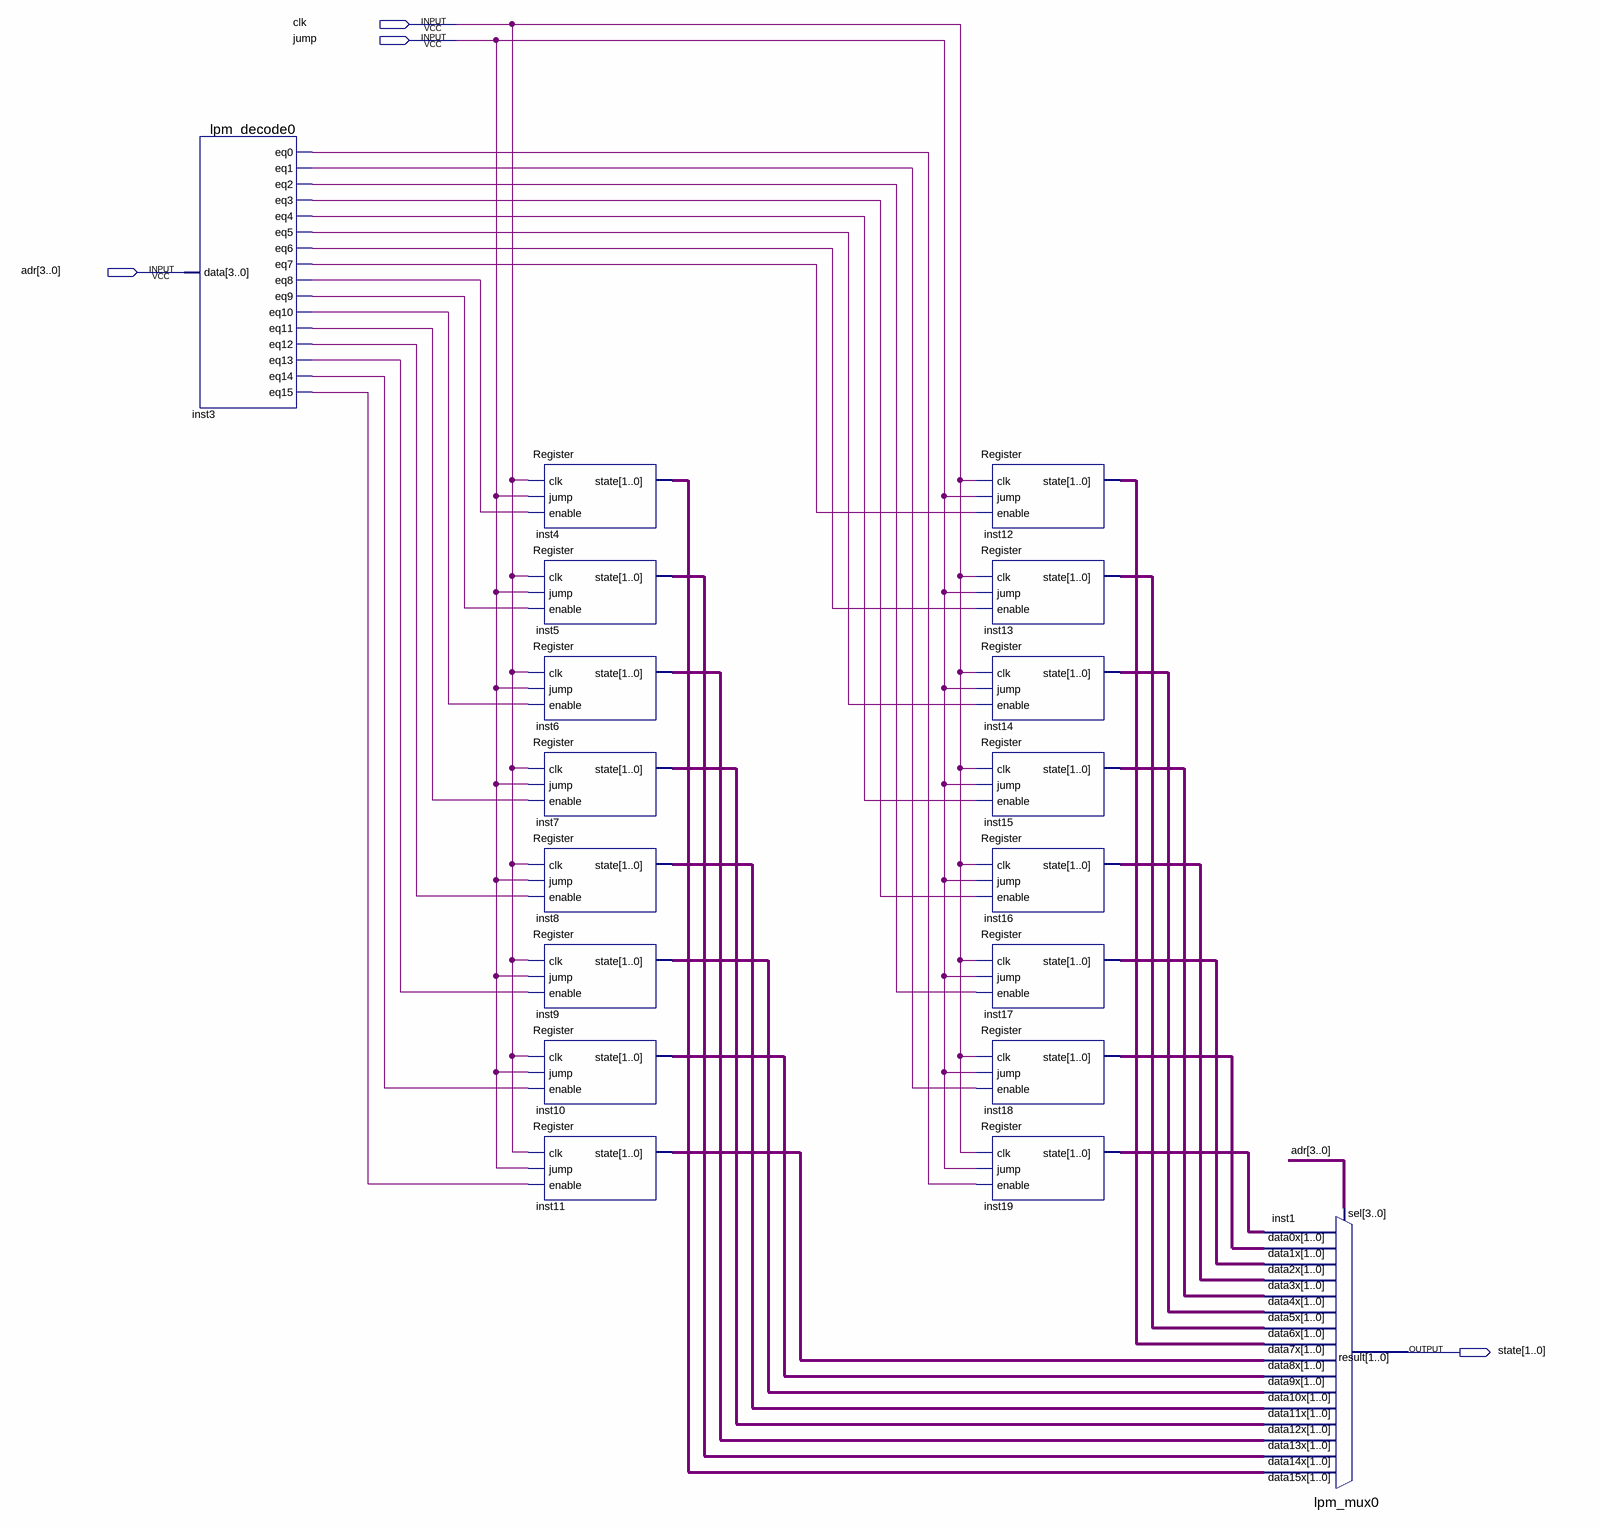
[diagram p0: schematic sheet]
// Quartus schematic PHT.bdf as structural Verilog: 18 symbols, 4 pins
module PHT (
  input  clk,
  input  jump,
  input  [3:0] adr,
  output [1:0] state
);

  wire inst3_eq0, inst3_eq1, inst3_eq2, inst3_eq3, inst3_eq4, inst3_eq5, inst3_eq6, inst3_eq7, inst3_eq8,
       inst3_eq9, inst3_eq10, inst3_eq11, inst3_eq12, inst3_eq13, inst3_eq14, inst3_eq15;
  wire [1:0] inst4_state, inst5_state, inst6_state, inst7_state, inst8_state, inst9_state, inst10_state,
       inst11_state, inst12_state, inst13_state, inst14_state, inst15_state, inst16_state, inst17_state,
       inst18_state, inst19_state;

  lpm_decode0 inst3 (
    .data(adr), .eq0(inst3_eq0), .eq1(inst3_eq1), .eq2(inst3_eq2), .eq3(inst3_eq3), .eq4(inst3_eq4),
    .eq5(inst3_eq5), .eq6(inst3_eq6), .eq7(inst3_eq7), .eq8(inst3_eq8), .eq9(inst3_eq9), .eq10(inst3_eq10),
    .eq11(inst3_eq11), .eq12(inst3_eq12), .eq13(inst3_eq13), .eq14(inst3_eq14), .eq15(inst3_eq15));
  Register inst4 (.clk(clk), .jump(jump), .enable(inst3_eq8), .state(inst4_state));
  Register inst5 (.clk(clk), .jump(jump), .enable(inst3_eq9), .state(inst5_state));
  Register inst6 (.clk(clk), .jump(jump), .enable(inst3_eq10), .state(inst6_state));
  Register inst7 (.clk(clk), .jump(jump), .enable(inst3_eq11), .state(inst7_state));
  Register inst8 (.clk(clk), .jump(jump), .enable(inst3_eq12), .state(inst8_state));
  Register inst9 (.clk(clk), .jump(jump), .enable(inst3_eq13), .state(inst9_state));
  Register inst10 (.clk(clk), .jump(jump), .enable(inst3_eq14), .state(inst10_state));
  Register inst11 (.clk(clk), .jump(jump), .enable(inst3_eq15), .state(inst11_state));
  Register inst12 (.clk(clk), .jump(jump), .enable(inst3_eq7), .state(inst12_state));
  Register inst13 (.clk(clk), .jump(jump), .enable(inst3_eq6), .state(inst13_state));
  Register inst14 (.clk(clk), .jump(jump), .enable(inst3_eq5), .state(inst14_state));
  Register inst15 (.clk(clk), .jump(jump), .enable(inst3_eq4), .state(inst15_state));
  Register inst16 (.clk(clk), .jump(jump), .enable(inst3_eq3), .state(inst16_state));
  Register inst17 (.clk(clk), .jump(jump), .enable(inst3_eq2), .state(inst17_state));
  Register inst18 (.clk(clk), .jump(jump), .enable(inst3_eq1), .state(inst18_state));
  Register inst19 (.clk(clk), .jump(jump), .enable(inst3_eq0), .state(inst19_state));
  lpm_mux0 inst1 (
    .data15x(inst4_state), .data14x(inst5_state), .data13x(inst6_state), .data12x(inst7_state),
    .data11x(inst8_state), .data10x(inst9_state), .data9x(inst10_state), .data8x(inst11_state),
    .data7x(inst12_state), .data6x(inst13_state), .data5x(inst14_state), .data4x(inst15_state),
    .data3x(inst16_state), .data2x(inst17_state), .data1x(inst18_state), .data0x(inst19_state), .sel(adr),
    .result(state));
endmodule
